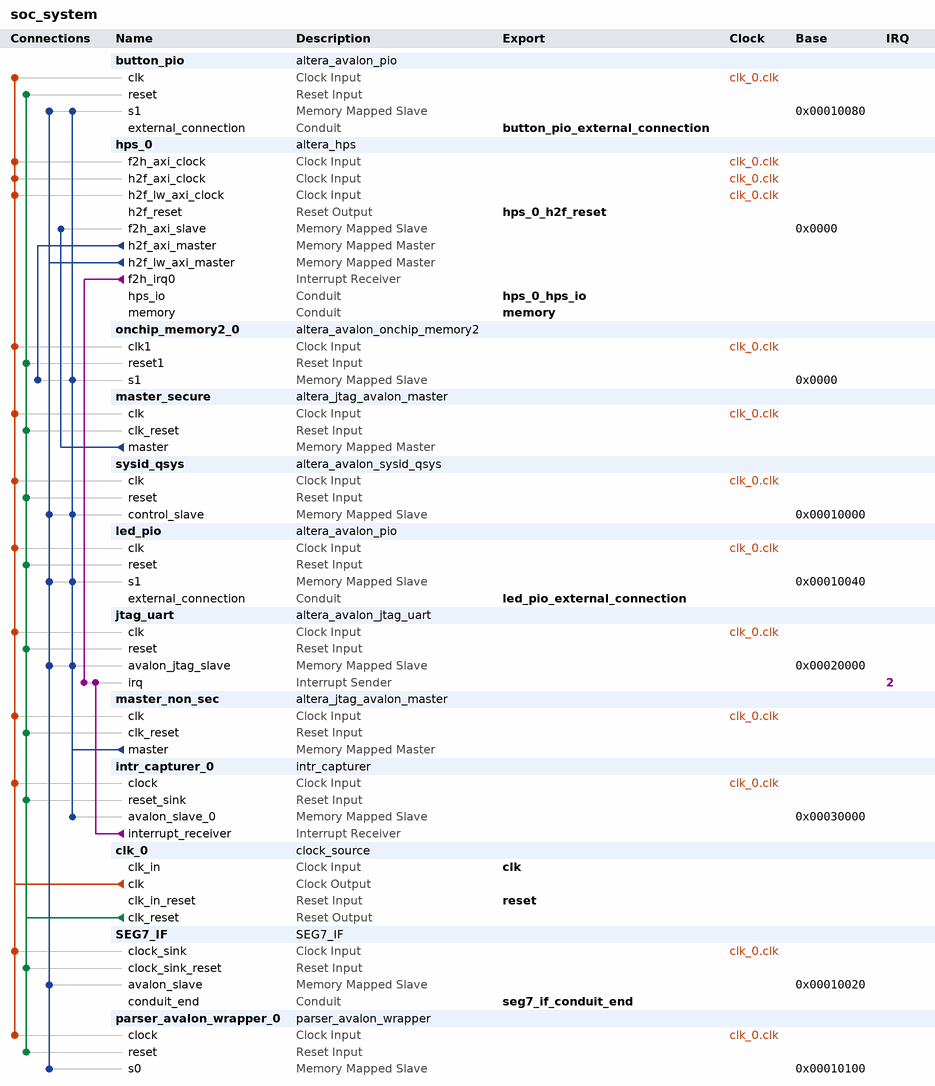
[diagram p0: system contents]
# Platform Designer (Qsys) system soc_system, Cyclone V 5CSEMA5F31C6
# Parameters at their usual value, and those the tool derives, are not listed.
package require -exact qsys 25.1
create_system soc_system
set_project_property DEVICE_FAMILY {Cyclone V}
set_project_property DEVICE 5CSEMA5F31C6

add_instance button_pio altera_avalon_pio 25.1
set_instance_parameter_value button_pio bitClearingEdgeCapReg true
set_instance_parameter_value button_pio captureEdge true
set_instance_parameter_value button_pio direction Input
set_instance_parameter_value button_pio edgeType FALLING
set_instance_parameter_value button_pio irqType EDGE
set_instance_parameter_value button_pio width 4

add_instance hps_0 altera_hps 25.1
set_instance_parameter_value hps_0 EMAC1_Mode RGMII
set_instance_parameter_value hps_0 EMAC1_PinMuxing {HPS I/O Set 0}
set_instance_parameter_value hps_0 F2SCLK_COLDRST_Enable false
set_instance_parameter_value hps_0 F2SCLK_DBGRST_Enable false
set_instance_parameter_value hps_0 F2SCLK_WARMRST_Enable false
set_instance_parameter_value hps_0 F2SINTERRUPT_Enable true
set_instance_parameter_value hps_0 F2S_Width 2
set_instance_parameter_value hps_0 FPGA_PERIPHERAL_OUTPUT_CLOCK_FREQ_EMAC0_GTX_CLK 100
set_instance_parameter_value hps_0 FPGA_PERIPHERAL_OUTPUT_CLOCK_FREQ_EMAC0_MD_CLK 100.0
set_instance_parameter_value hps_0 FPGA_PERIPHERAL_OUTPUT_CLOCK_FREQ_EMAC1_GTX_CLK 100
set_instance_parameter_value hps_0 FPGA_PERIPHERAL_OUTPUT_CLOCK_FREQ_EMAC1_MD_CLK 100.0
set_instance_parameter_value hps_0 HPS_PROTOCOL DDR3
set_instance_parameter_value hps_0 I2C0_Mode I2C
set_instance_parameter_value hps_0 I2C0_PinMuxing {HPS I/O Set 0}
set_instance_parameter_value hps_0 I2C1_Mode I2C
set_instance_parameter_value hps_0 I2C1_PinMuxing {HPS I/O Set 0}
set_instance_parameter_value hps_0 LWH2F_Enable true
set_instance_parameter_value hps_0 MEM_BANKADDR_WIDTH 3
set_instance_parameter_value hps_0 MEM_CLK_FREQ 400.0
set_instance_parameter_value hps_0 MEM_COL_ADDR_WIDTH 10
set_instance_parameter_value hps_0 MEM_DQ_WIDTH 32
set_instance_parameter_value hps_0 MEM_DRV_STR RZQ/7
set_instance_parameter_value hps_0 MEM_ROW_ADDR_WIDTH 15
set_instance_parameter_value hps_0 MEM_RTT_NOM RZQ/4
set_instance_parameter_value hps_0 MEM_RTT_WR RZQ/4
set_instance_parameter_value hps_0 MEM_TCL 11
set_instance_parameter_value hps_0 MEM_TFAW_NS 30.0
set_instance_parameter_value hps_0 MEM_TRAS_NS 35.0
set_instance_parameter_value hps_0 MEM_TRCD_NS 13.75
set_instance_parameter_value hps_0 MEM_TRFC_NS 260.0
set_instance_parameter_value hps_0 MEM_TRP_NS 13.75
set_instance_parameter_value hps_0 MEM_VENDOR JEDEC
set_instance_parameter_value hps_0 MEM_WTCL 8
set_instance_parameter_value hps_0 QSPI_Mode {1 SS}
set_instance_parameter_value hps_0 QSPI_PinMuxing {HPS I/O Set 0}
set_instance_parameter_value hps_0 REF_CLK_FREQ 25.0
set_instance_parameter_value hps_0 S2FCLK_USER2CLK 5
set_instance_parameter_value hps_0 S2F_Width 3
set_instance_parameter_value hps_0 SDIO_Mode {4-bit Data}
set_instance_parameter_value hps_0 SDIO_PinMuxing {HPS I/O Set 0}
set_instance_parameter_value hps_0 SPIM1_Mode {Single Slave Select}
set_instance_parameter_value hps_0 SPIM1_PinMuxing {HPS I/O Set 0}
set_instance_parameter_value hps_0 STM_Enable false
set_instance_parameter_value hps_0 TIMING_BOARD_AC_SKEW 0.03
set_instance_parameter_value hps_0 TIMING_BOARD_AC_TO_CK_SKEW 0.0
set_instance_parameter_value hps_0 TIMING_BOARD_DQ_TO_DQS_SKEW 0.0
set_instance_parameter_value hps_0 TIMING_BOARD_MAX_CK_DELAY 0.03
set_instance_parameter_value hps_0 TIMING_BOARD_MAX_DQS_DELAY 0.02
set_instance_parameter_value hps_0 TIMING_BOARD_SKEW_BETWEEN_DQS 0.08
set_instance_parameter_value hps_0 TIMING_BOARD_SKEW_CKDQS_DIMM_MAX 0.16
set_instance_parameter_value hps_0 TIMING_BOARD_SKEW_CKDQS_DIMM_MIN 0.09
set_instance_parameter_value hps_0 TIMING_BOARD_SKEW_WITHIN_DQS 0.01
set_instance_parameter_value hps_0 TIMING_TDH 65
set_instance_parameter_value hps_0 TIMING_TDQSCK 255
set_instance_parameter_value hps_0 TIMING_TDQSQ 125
set_instance_parameter_value hps_0 TIMING_TDS 30
set_instance_parameter_value hps_0 TIMING_TIH 140
set_instance_parameter_value hps_0 TIMING_TIS 180
set_instance_parameter_value hps_0 TIMING_TQSH 0.4
set_instance_parameter_value hps_0 UART0_Mode {No Flow Control}
set_instance_parameter_value hps_0 UART0_PinMuxing {HPS I/O Set 0}
set_instance_parameter_value hps_0 USB1_Mode SDR
set_instance_parameter_value hps_0 USB1_PinMuxing {HPS I/O Set 0}
set_instance_parameter_value hps_0 desired_cfg_clk_mhz 100.0
set_instance_parameter_value hps_0 desired_qspi_clk_mhz 400.0

add_instance onchip_memory2_0 altera_avalon_onchip_memory2 25.1
set_instance_parameter_value onchip_memory2_0 dataWidth 64
set_instance_parameter_value onchip_memory2_0 dualPort false
set_instance_parameter_value onchip_memory2_0 initMemContent true
set_instance_parameter_value onchip_memory2_0 initializationFileName onchip_memory2_0
set_instance_parameter_value onchip_memory2_0 memorySize 256

add_instance master_secure altera_jtag_avalon_master 25.1

add_instance sysid_qsys altera_avalon_sysid_qsys 25.1
set_instance_parameter_value sysid_qsys id -1395322110

add_instance led_pio altera_avalon_pio 25.1
set_instance_parameter_value led_pio direction Output
set_instance_parameter_value led_pio resetValue 1023
set_instance_parameter_value led_pio width 10

add_instance jtag_uart altera_avalon_jtag_uart 25.1
set_instance_parameter_value jtag_uart allowMultipleConnections true
set_instance_parameter_value jtag_uart simInteractiveOptions INTERACTIVE_ASCII_OUTPUT

add_instance master_non_sec altera_jtag_avalon_master 25.1

add_instance intr_capturer_0 intr_capturer 100.99.98.97

add_instance clk_0 clock_source 25.1
set_instance_parameter_value clk_0 clockFrequency 50000000

add_instance SEG7_IF SEG7_IF 1.0
set_instance_parameter_value SEG7_IF SEG7_NUM 6

add_instance parser_avalon_wrapper_0 parser_avalon_wrapper 1.0

# connections
add_connection clk_0.clk button_pio.clk clock
add_connection clk_0.clk hps_0.f2h_axi_clock clock
add_connection clk_0.clk hps_0.h2f_axi_clock clock
add_connection clk_0.clk hps_0.h2f_lw_axi_clock clock
add_connection clk_0.clk intr_capturer_0.clock clock
add_connection clk_0.clk jtag_uart.clk clock
add_connection clk_0.clk led_pio.clk clock
add_connection clk_0.clk master_non_sec.clk clock
add_connection clk_0.clk master_secure.clk clock
add_connection clk_0.clk onchip_memory2_0.clk1 clock
add_connection clk_0.clk parser_avalon_wrapper_0.clock clock
add_connection clk_0.clk SEG7_IF.clock_sink clock
add_connection clk_0.clk sysid_qsys.clk clock
add_connection clk_0.clk_reset button_pio.reset reset
add_connection clk_0.clk_reset intr_capturer_0.reset_sink reset
add_connection clk_0.clk_reset jtag_uart.reset reset
add_connection clk_0.clk_reset led_pio.reset reset
add_connection clk_0.clk_reset master_non_sec.clk_reset reset
add_connection clk_0.clk_reset master_secure.clk_reset reset
add_connection clk_0.clk_reset onchip_memory2_0.reset1 reset
add_connection clk_0.clk_reset parser_avalon_wrapper_0.reset reset
add_connection clk_0.clk_reset SEG7_IF.clock_sink_reset reset
add_connection clk_0.clk_reset sysid_qsys.reset reset
add_connection hps_0.h2f_axi_master onchip_memory2_0.s1 avalon
set_connection_parameter_value hps_0.h2f_axi_master/onchip_memory2_0.s1 baseAddress 0x0000
add_connection hps_0.h2f_lw_axi_master button_pio.s1 avalon
set_connection_parameter_value hps_0.h2f_lw_axi_master/button_pio.s1 baseAddress 0x00010080
add_connection hps_0.h2f_lw_axi_master jtag_uart.avalon_jtag_slave avalon
set_connection_parameter_value hps_0.h2f_lw_axi_master/jtag_uart.avalon_jtag_slave baseAddress 0x00020000
add_connection hps_0.h2f_lw_axi_master led_pio.s1 avalon
set_connection_parameter_value hps_0.h2f_lw_axi_master/led_pio.s1 baseAddress 0x00010040
add_connection hps_0.h2f_lw_axi_master parser_avalon_wrapper_0.s0 avalon
set_connection_parameter_value hps_0.h2f_lw_axi_master/parser_avalon_wrapper_0.s0 baseAddress 0x00010100
add_connection hps_0.h2f_lw_axi_master SEG7_IF.avalon_slave avalon
set_connection_parameter_value hps_0.h2f_lw_axi_master/SEG7_IF.avalon_slave baseAddress 0x00010020
add_connection hps_0.h2f_lw_axi_master sysid_qsys.control_slave avalon
set_connection_parameter_value hps_0.h2f_lw_axi_master/sysid_qsys.control_slave baseAddress 0x00010000
add_connection master_non_sec.master button_pio.s1 avalon
set_connection_parameter_value master_non_sec.master/button_pio.s1 baseAddress 0x00010080
add_connection master_non_sec.master intr_capturer_0.avalon_slave_0 avalon
set_connection_parameter_value master_non_sec.master/intr_capturer_0.avalon_slave_0 baseAddress 0x00030000
add_connection master_non_sec.master jtag_uart.avalon_jtag_slave avalon
set_connection_parameter_value master_non_sec.master/jtag_uart.avalon_jtag_slave baseAddress 0x00020000
add_connection master_non_sec.master led_pio.s1 avalon
set_connection_parameter_value master_non_sec.master/led_pio.s1 baseAddress 0x00010040
add_connection master_non_sec.master onchip_memory2_0.s1 avalon
set_connection_parameter_value master_non_sec.master/onchip_memory2_0.s1 baseAddress 0x0000
add_connection master_non_sec.master sysid_qsys.control_slave avalon
set_connection_parameter_value master_non_sec.master/sysid_qsys.control_slave baseAddress 0x00010000
add_connection master_secure.master hps_0.f2h_axi_slave avalon
set_connection_parameter_value master_secure.master/hps_0.f2h_axi_slave baseAddress 0x0000
add_connection hps_0.f2h_irq0 jtag_uart.irq interrupt
set_connection_parameter_value hps_0.f2h_irq0/jtag_uart.irq irqNumber 2
add_connection intr_capturer_0.interrupt_receiver jtag_uart.irq interrupt
set_connection_parameter_value intr_capturer_0.interrupt_receiver/jtag_uart.irq irqNumber 2

# exported interfaces
add_interface button_pio_external_connection conduit end
set_interface_property button_pio_external_connection EXPORT_OF button_pio.external_connection
add_interface clk clock sink
set_interface_property clk EXPORT_OF clk_0.clk_in
add_interface hps_0_h2f_reset reset source
set_interface_property hps_0_h2f_reset EXPORT_OF hps_0.h2f_reset
add_interface hps_0_hps_io conduit end
set_interface_property hps_0_hps_io EXPORT_OF hps_0.hps_io
add_interface led_pio_external_connection conduit end
set_interface_property led_pio_external_connection EXPORT_OF led_pio.external_connection
add_interface memory conduit end
set_interface_property memory EXPORT_OF hps_0.memory
add_interface reset reset sink
set_interface_property reset EXPORT_OF clk_0.clk_in_reset
add_interface seg7_if_conduit_end conduit end
set_interface_property seg7_if_conduit_end EXPORT_OF SEG7_IF.conduit_end

set_interconnect_requirement {$system} qsys_mm.clockCrossingAdapter HANDSHAKE
set_interconnect_requirement {$system} qsys_mm.maxAdditionalLatency 1

save_system soc_system.qsys
